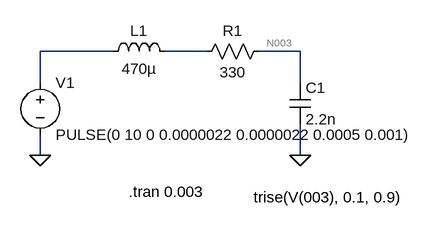
[diagram p0: schematic Ckt3_2_2.asc]
Ckt3_2_2.asc, the LTspice schematic file:
Version 4
SHEET 1 880 680
WIRE 144 64 32 64
WIRE 288 64 224 64
WIRE 432 64 368 64
WIRE 32 112 32 64
WIRE 432 112 432 64
WIRE 32 224 32 192
WIRE 432 224 432 176
FLAG 32 224 0
FLAG 432 224 0
SYMBOL voltage 32 96 R0
WINDOW 123 0 0 Left 0
WINDOW 39 0 0 Left 0
SYMATTR InstName V1
SYMATTR Value PULSE(0 10 0 0.0000022 0.0000022 0.0005 0.001)
SYMBOL ind 128 80 R270
WINDOW 0 32 56 VTop 2
WINDOW 3 5 56 VBottom 2
SYMATTR InstName L1
SYMATTR Value 470µ
SYMBOL res 384 48 R90
WINDOW 0 0 56 VBottom 2
WINDOW 3 32 56 VTop 2
SYMATTR InstName R1
SYMATTR Value 330
SYMBOL cap 416 112 R0
SYMATTR InstName C1
SYMATTR Value 2.2n
TEXT 168 280 Left 2 !.tran 0.003
TEXT 360 288 Left 2 !trise(V(003), 0.1, 0.9)

The netlist it stands for:
* Ckt3_2_2.asc
V1 N001 0 PULSE(0 10 0 0.0000022 0.0000022 0.0005 0.001)
L1 N001 N002 470µ
R1 N003 N002 330
C1 N003 0 2.2n
.tran 0.003
trise(V(003), 0.1, 0.9)
.backanno
.end

* Results of the author's LTspice run, read from the files saved beside the schematic
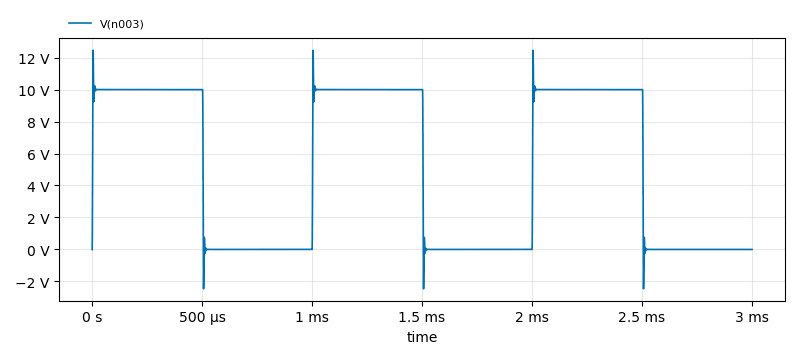
[diagram p1: Transient Analysis of Ckt3_2_2.asc, plotted from the saved traces]
* Transient Analysis, 1 run:
*   V(n003): min -2.461 V, max 12.45 V, average 5.022 V, rms 7.088 V, last 0 V